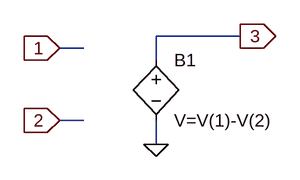
[diagram p0: schematic Substractor.asc]
Substractor.asc, the LTspice schematic file:
Version 4
SHEET 1 880 680
WIRE 272 112 160 112
WIRE 64 128 32 128
WIRE 160 144 160 112
WIRE 64 224 32 224
WIRE 160 256 160 224
FLAG 32 128 1
IOPIN 32 128 In
FLAG 32 224 2
IOPIN 32 224 In
FLAG 160 256 0
FLAG 272 112 3
IOPIN 272 112 Out
SYMBOL bv 160 128 R0
SYMATTR InstName B1
SYMATTR Value V=V(1)-V(2)

The netlist it stands for:
* Substractor.asc
B1 3 0 V=V(1)-V(2)
.backanno
.end